# Altium schematic sheet PLL.SchDoc
size 420 x 297 mm; SheetNumber: 5; SheetTotal: 7
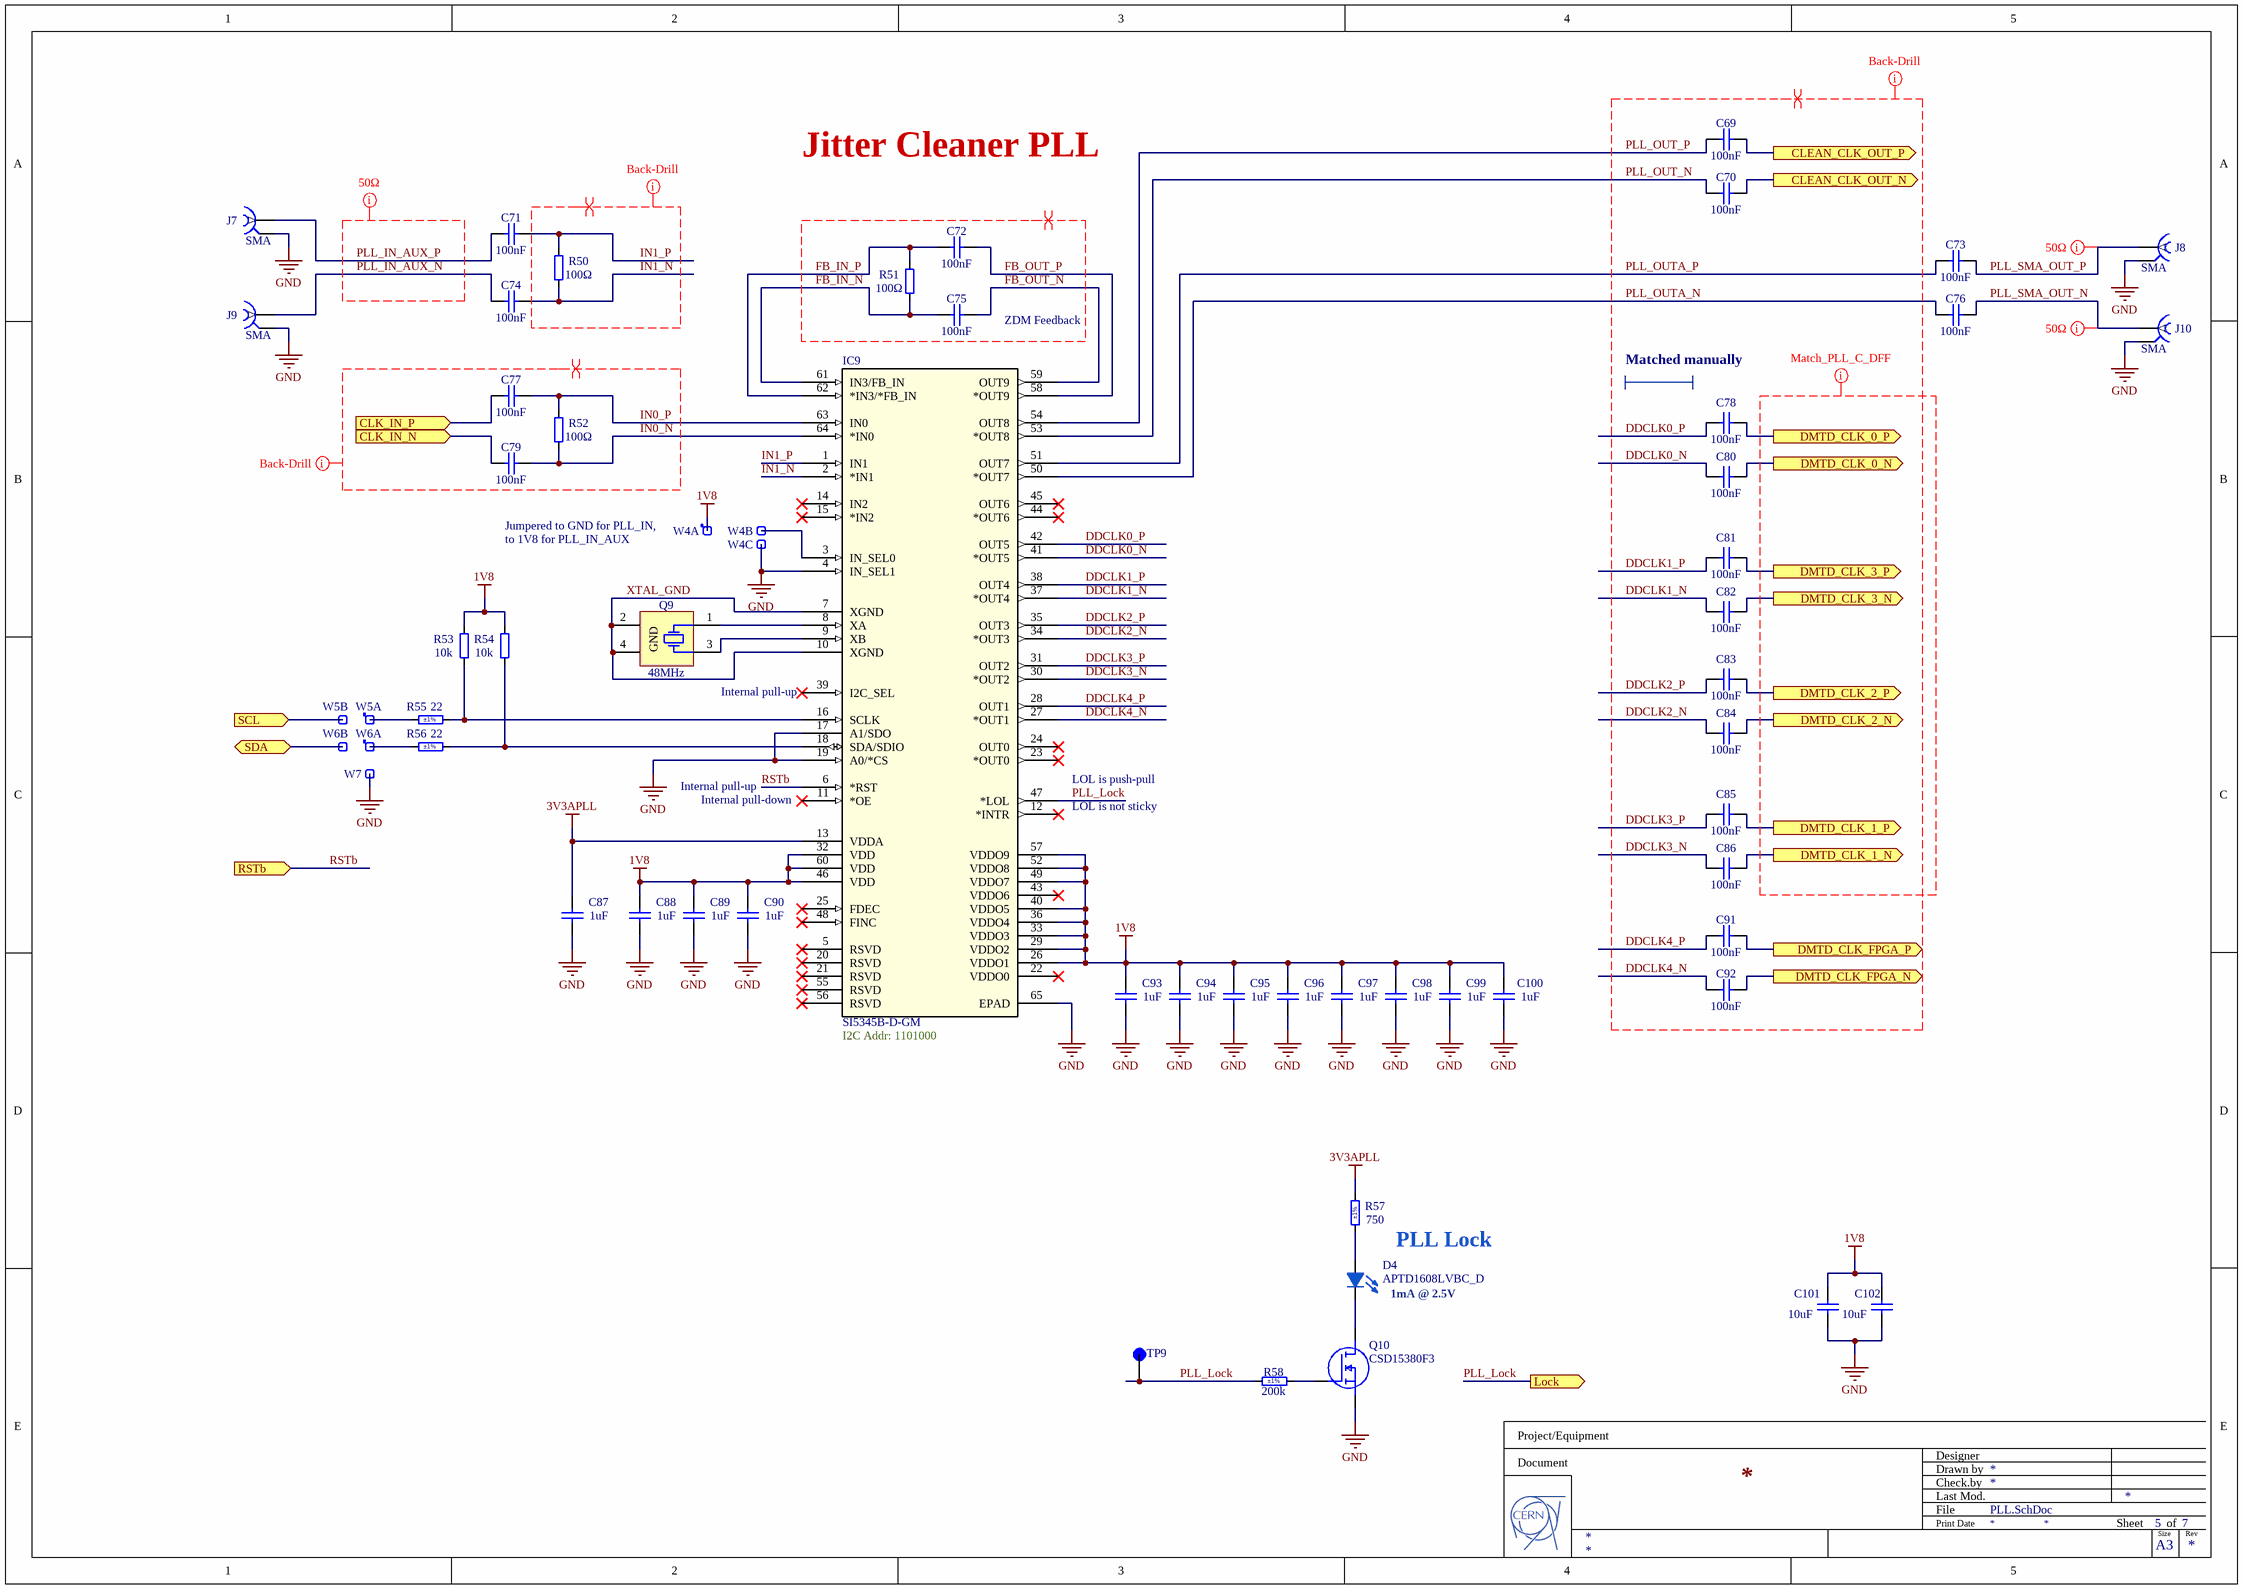
[diagram p0: PLL.SchDoc]

## Parts
C69  100nF  [MURATA_HI_DENSITY_0201]
C70  100nF  [MURATA_HI_DENSITY_0201]
C71  100nF  [MURATA_HI_DENSITY_0201]
C72  100nF  [MURATA_HI_DENSITY_0201]
C73  100nF  [MURATA_HI_DENSITY_0201]
C74  100nF  [MURATA_HI_DENSITY_0201]
C75  100nF  [MURATA_HI_DENSITY_0201]
C76  100nF  [MURATA_HI_DENSITY_0201]
C77  100nF  [MURATA_HI_DENSITY_0201]
C78  100nF  [MURATA_HI_DENSITY_0201]
C79  100nF  [MURATA_HI_DENSITY_0201]
C80  100nF  [MURATA_HI_DENSITY_0201]
C81  100nF  [MURATA_HI_DENSITY_0201]
C82  100nF  [MURATA_HI_DENSITY_0201]
C83  100nF  [MURATA_HI_DENSITY_0201]
C84  100nF  [MURATA_HI_DENSITY_0201]
C85  100nF  [MURATA_HI_DENSITY_0201]
C86  100nF  [MURATA_HI_DENSITY_0201]
C87  1uF  [CAPC1005X55N]
C88  1uF  [CAPC1005X55N]
C89  1uF  [CAPC1005X55N]
C90  1uF  [CAPC1005X55N]
C91  100nF  [MURATA_HI_DENSITY_0201]
C92  100nF  [MURATA_HI_DENSITY_0201]
C93  1uF  [CAPC1005X55N]
C94  1uF  [CAPC1005X55N]
C95  1uF  [CAPC1005X55N]
C96  1uF  [CAPC1005X55N]
C97  1uF  [CAPC1005X55N]
C98  1uF  [CAPC1005X55N]
C99  1uF  [CAPC1005X55N]
C100  1uF  [CAPC1005X55N]
C101  10uF  [CAPC1608X87N]
C102  10uF  [CAPC1608X87N]
D4  APTD1608LVBC_D  [LEDC1608X110N]
IC9  SI5345B-D-GM  [QFN50P900X900X90-65N-D]
J7  SMA  [SAMTEC_SMA-J-P-H-ST-MT1]
J8  SMA  [SAMTEC_SMA-J-P-H-ST-MT1]
J9  SMA  [SAMTEC_SMA-J-P-H-ST-MT1]
J10  SMA  [SAMTEC_SMA-J-P-H-ST-MT1]
Q9  48MHz  [XTAL_KYOCERA_CX3225SB]
Q10  CSD15380F3  [CSD15380F3]
R50  100Ω  [MURATA_HI_DENSITY_0201]
R51  100Ω  [MURATA_HI_DENSITY_0201]
R52  100Ω  [MURATA_HI_DENSITY_0201]
R53  10k  [MURATA_HI_DENSITY_0201]
R54  10k  [MURATA_HI_DENSITY_0201]
R55  22  Tolerance: ±1%  [RESC1005X40N]
R56  22  Tolerance: ±1%  [RESC1005X40N]
R57  750  Tolerance: ±1%  [RESC1005X40N]
R58  200k  Tolerance: ±1%  [RESC1005X40N]
TP9  RCU-0C  [TP+195X110]  (value not drawn)
W4  Header 3  [SAMTEC_HTSW-103-23-L-S]  (value not drawn)  (parts A,B,C of 3)
W5  Header 2  [SAMTEC_HTSW-102-23-L-S]  (value not drawn)  (parts A,B of 2)
W6  Header 2  [SAMTEC_HTSW-102-23-L-S]  (value not drawn)  (parts A,B of 2)
W7  Header 1  [SAMTEC_HTSW-101-23-L-S]  (value not drawn)

## Ports
CLEAN_CLK_OUT_N (out), CLEAN_CLK_OUT_P (out), CLK_IN_N (in), CLK_IN_P (in), DMTD_CLK_0_N (out), DMTD_CLK_0_P (out), DMTD_CLK_1_N (out), DMTD_CLK_1_P (out), DMTD_CLK_2_N (out), DMTD_CLK_2_P (out), DMTD_CLK_3_N (out), DMTD_CLK_3_P (out), DMTD_CLK_FPGA_N (out), DMTD_CLK_FPGA_P (out), Lock (out), RSTb (in), SCL (in), SDA (bidir)

## Nets
1V8: C88.2 C89.2 C90.2 C93.2 C94.2 C95.2 C96.2 C97.2 C98.2 C99.2 C100.2 C101.2 C102.2 IC9.26(VDDO1) IC9.29(VDDO2) IC9.32(VDD) IC9.33(VDDO3) IC9.36(VDDO4) IC9.40(VDDO5) IC9.46(VDD) IC9.49(VDDO7) IC9.52(VDDO8) IC9.57(VDDO9) IC9.60(VDD) R53.2 R54.2 W4.1
3V3APLL: C87.2 IC9.13(VDDA) R57.2
GND: C87.1 C88.1 C89.1 C90.1 C93.1 C94.1 C95.1 C96.1 C97.1 C98.1 C99.1 C100.1 C101.1 C102.1 IC9.4(IN_SEL1) IC9.17(A1/SDO) IC9.19(A0/*CS) IC9.65(EPAD) J7.2 J8.2 J9.2 J10.2 Q10.2(S) W4.3 W7.1
CLEAN_CLK_OUT_N: C70.2 ; port CLEAN_CLK_OUT_N
CLEAN_CLK_OUT_P: C69.2 ; port CLEAN_CLK_OUT_P
CLK_IN_N: C79.2 ; port CLK_IN_N
CLK_IN_P: C77.2 ; port CLK_IN_P
DDCLK0_N: C80.1 IC9.41(*OUT5)
DDCLK0_P: C78.1 IC9.42(OUT5)
DDCLK1_N: C82.1 IC9.37(*OUT4)
DDCLK1_P: C81.1 IC9.38(OUT4)
DDCLK2_N: C84.1 IC9.34(*OUT3)
DDCLK2_P: C83.1 IC9.35(OUT3)
DDCLK3_N: C86.1 IC9.30(*OUT2)
DDCLK3_P: C85.1 IC9.31(OUT2)
DDCLK4_N: C92.1 IC9.27(*OUT1)
DDCLK4_P: C91.1 IC9.28(OUT1)
DMTD_CLK_0_N: C80.2 ; port DMTD_CLK_0_N
DMTD_CLK_0_P: C78.2 ; port DMTD_CLK_0_P
DMTD_CLK_1_N: C86.2 ; port DMTD_CLK_1_N
DMTD_CLK_1_P: C85.2 ; port DMTD_CLK_1_P
DMTD_CLK_2_N: C84.2 ; port DMTD_CLK_2_N
DMTD_CLK_2_P: C83.2 ; port DMTD_CLK_2_P
DMTD_CLK_3_N: C82.2 ; port DMTD_CLK_3_N
DMTD_CLK_3_P: C81.2 ; port DMTD_CLK_3_P
DMTD_CLK_FPGA_N: C92.2 ; port DMTD_CLK_FPGA_N
DMTD_CLK_FPGA_P: C91.2 ; port DMTD_CLK_FPGA_P
FB_IN_N: C75.1 IC9.61(IN3/FB_IN) R51.1
FB_IN_P: C72.1 IC9.62(*IN3/*FB_IN) R51.2
FB_OUT_N: C75.2 IC9.59(OUT9)
FB_OUT_P: C72.2 IC9.58(*OUT9)
IN0_N: C79.1 IC9.64(*IN0) R52.1
IN0_P: C77.1 IC9.63(IN0) R52.2
IN1_N: C74.1 IC9.2(*IN1) R50.1
IN1_P: C71.1 IC9.1(IN1) R50.2
PLL_IN_AUX_N: C74.2 J9.1
PLL_IN_AUX_P: C71.2 J7.1
PLL_Lock: IC9.47(*LOL) R58.1 TP9.1(TP) ; port Lock
PLL_OUT_N: C70.1 IC9.53(*OUT8)
PLL_OUT_P: C69.1 IC9.54(OUT8)
PLL_OUTA_N: C76.1 IC9.50(*OUT7)
PLL_OUTA_P: C73.1 IC9.51(OUT7)
PLL_SMA_OUT_N: C76.2 J10.1
PLL_SMA_OUT_P: C73.2 J8.1
RSTb: IC9.6(*RST) ; port RSTb
SCL: W5.2 ; port SCL
SDA: W6.2 ; port SDA
XTAL_GND: IC9.7(XGND) IC9.10(XGND) Q9.2(GND) Q9.4(GND)
NetD4_1: D4.1(K) Q10.3(D)
NetD4_2: D4.2(A) R57.1
NetIC9_3: IC9.3(IN_SEL0) W4.2
NetIC9_8: IC9.8(XA) Q9.1(X)
NetIC9_9: IC9.9(XB) Q9.3(X)
NetIC9_16: IC9.16(SCLK) R53.1 R55.2
NetIC9_18: IC9.18(SDA/SDIO) R54.1 R56.2
NetQ10_1: Q10.1(G) R58.2
NetR55_1: R55.1 W5.1
NetR56_1: R56.1 W6.1

Not connected (* = marked no-connect by the designer): IC9 5(RSVD)* 11(*OE)* 12(*INTR)* 14(IN2)* 15(*IN2)* 20(RSVD)* 21(RSVD)* 22(VDDO0)* 23(*OUT0)* 24(OUT0)* 25(FDEC)* 39(I2C_SEL)* 43(VDDO6)* 44(*OUT6)* 45(OUT6)* 48(FINC)* 55(RSVD)* 56(RSVD)*

## Layout directives
differential pair: DDCLK0_N, DDCLK0_P, DDCLK1_N, DDCLK1_P, DDCLK2_N, DDCLK2_P, DDCLK3_N, DDCLK3_P, DDCLK4_N, DDCLK4_P, FB_IN_N, FB_IN_P, FB_OUT_N, FB_OUT_P, IN0_N, IN0_P, IN1_N, IN1_P, PLL_OUT_N, PLL_OUT_P, PLL_OUTA_N, PLL_OUTA_P
net class Back-Drill: DDCLK0_N, DDCLK0_P, DDCLK1_N, DDCLK1_P, DDCLK2_N, DDCLK2_P, DDCLK3_N, DDCLK3_P, DDCLK4_N, DDCLK4_P, IN0_N, IN0_P, IN1_N, IN1_P, PLL_OUT_N, PLL_OUT_P, PLL_OUTA_N, PLL_OUTA_P
net class Match_PLL_C_DFF: DDCLK0_N, DDCLK0_P, DDCLK1_N, DDCLK1_P, DDCLK2_N, DDCLK2_P, DDCLK3_N, DDCLK3_P, DDCLK4_N, DDCLK4_P, PLL_OUT_N, PLL_OUT_P, PLL_OUTA_N, PLL_OUTA_P
net class 50ohm: PLL_IN_AUX_N, PLL_IN_AUX_P, PLL_SMA_OUT_N, PLL_SMA_OUT_P

## Notes on the sheet
- Jitter Cleaner PLL
- ZDM Feedback
- Matched manually
- Jumpered to GND for PLL_IN, to 1V8 for PLL_IN_AUX
- (near IC9) Internal pull-up
- Internal pull-up
- (near IC9) Internal pull-down
- LOL is push-pull
- LOL is not sticky
- (near IC9) I2C Addr: 1101000
- PLL Lock
- 1mA @ 2.5V
- Project/Equipment
- Document
- Designer
- Drawn by
- Check.by
- File
- Last Mod.
- Print Date
- Sheet
- Size
- A3
- of
- Rev

## Library data of the parts
C69-C86 C91 C92 = C0201-100nF-high-density: GRM033R61C104KE14; Vmax: 16V; Value: 100nF
C87-C90 C93-C100 = CC0402_1UF_16V_10%_X5R: GRM153B30J105ME15; Part Description: SMD Multilayer Chip Ceramic Capacitor; Manufacturer: GENERIC; Manufacturer1 Part Number: C1005X5R1C105KT; Voltage: 16V; TC: X5R; Tolerance: ±10%; Part Number: CC0402_1UF_16V_10%_X5R; Component Kind: Standard; Component Type: Standard; Pin Count: 2; Value: 1uF; Status: Preferred; Manufacturer Part Number: CC0402_1UF_16V_10%_X5R; Case: 0402; Mounted: Yes; Socket: No; SMD: Yes; Sense: No; Manufacturer1 Example: TDK; Manufacturer1 ComponentHeight: 0.55mm; HelpURL: \\cern.ch\dfs\Applications\Altium\Datasheets\CC0402_X5R_TDK_C.pdf; Author: CERN DEM JLC; CreateDate: 10/25/2012; LatestRevisionDate: 10/25/2012
C101 C102 = CC0603_10UF_6.3V_20%_X5R: C1608X5R1E106M080AC; Part Description: SMD Multilayer Chip Ceramic Capacitor; Manufacturer: GENERIC; Manufacturer1 Part Number: C0603C106M9PAC; Voltage: 6.3V; TC: X5R; Tolerance: ±20%; Part Number: CC0603_10UF_6.3V_20%_X5R; Component Kind: Standard; Component Type: Standard; Pin Count: 2; Value: 10uF; Status: Preferred; Manufacturer Part Number: CC0603_10uF_6.3V_20%_X5R; Case: 0603; Mounted: Yes; Socket: No; SMD: Yes; Sense: No; Manufacturer1 Example: KEMET; Manufacturer1 ComponentHeight: 0.95mm; HelpURL: \\cern.ch\dfs\Applications\Altium\Datasheets\CC0603_X5R_KEMET.pdf; Author: CERN DEM JLC; CreateDate: 03/12/2007; LatestRevisionDate: 03/12/2007
D4 = APTD1608LVBC_D: LED; Manufacturer_Name: Kingbright; Manufacturer_Part_Number: APTD1608LVBC/D; Datasheet Link: https://componentsearchengine.com/Datasheets/1/APTD1608LVBC_D.pdf; Height: 1.1mm; Mouser Part Number: 604-APTD1608LVBCD; Mouser Price/Stock: https://www.mouser.co.uk/ProductDetail/Kingbright/APTD1608LVBC-D?qs=6oMev5NRZMEfNSg5xIhlKA%3D%3D; Arrow Part Number: APTD1608LVBC/D; Arrow Price/Stock: https://www.arrow.com/en/products/aptd1608lvbcd/kingbright?utm_currency=USD&region=nac
IC9 = SI5345B-D-GM: Integrated Circuit; Manufacturer_Name: Skyworks; Datasheet Link: https://www.mouser.sg/datasheet/2/472/si5345_44_42_d_datasheet-2507675.pdf; Height: 0.9mm; Manufacturer_Part_Number: SI5345B-D-GM; Mouser Part Number: 634-SI5345B-D-GM; Mouser Price/Stock: https://www.mouser.co.uk/ProductDetail/Skyworks-Solutions-Inc/SI5345B-D-GM?qs=p9T7GgSe1IGHqFUKlxUKrA%3D%3D
J7-J10 = SAMTEC_SMA-J-P-H-ST-MT1: Part Description: 50 Ohms SMA Straight Mixed Technology PCB Jack; Manufacturer: SAMTEC; PressFit: No; Sense Comment: assembly limitations; Part Number: SAMTEC_SMA-J-P-H-ST-MT1; Component Kind: Standard; Component Type: Standard; Pin Count: 5; Family: SMA; Mounted: Yes; Socket: No; SMD: Yes; Sense: Yes; Status: Not Recommended; Manufacturer Part Number: SMA-J-P-H-ST-MT1; ComponentHeight: 7.95mm; HelpURL: \\cern.ch\dfs\Applications\Altium\Datasheets\SAMTEC_SMA-J-P-H-ST-MT1.pdf; Author: CERN DEM HF; CreateDate: 5/24/2023; LatestRevisionDate: 5/24/2023
Q9 = XTAL_48MHZ_KYOCERA_CX3225SB48000D0FPJC1: Crystal 4 pins 1=XTAL Control 2=GND3=XTAL 4=GND; Part Description: Tolerance: ±10ppm, Stability: ±15ppm, 8pF, -40°C to +85°C, Surface Mount Crystal; PressFit: No; Bonding: No; Part Number: XTAL_48MHZ_KYOCERA_CX3225SB48000D0FPJC1; Component Kind: Standard; Component Type: Standard; PackageDescription: SMD Crystal Kyocera, 4 Pins, 2.50mm L X 3.20mm W X 0.6mm H; Value: 48MHz; Manufacturer: KYOCERA; Manufacturer Part Number: CX3225SB48000D0FPJC1; Pin Count: 4; Mounted: Yes; Socket: No; SMD: Yes; Sense: No; ComponentHeight: 0.6mm; HelpURL: \\cern.ch\dfs\Applications\Altium\Datasheets\XTAL_KYOCERA_CX3225SB.pdf; Author: CERN DEM JLC; CreateDate: 6/5/2018; LatestRevisionDate: 6/5/2018
Q10 = CSD15380F3: MOSFET (N-Channel); Manufacturer_Name: Texas Instruments; Datasheet Link: https://www.ti.com/lit/ds/symlink/csd15380f3.pdf?ts=1641221366106&ref_url=https%253A%252F%252Fwww.google.com%252F; Height: 0.35mm; Manufacturer_Part_Number: CSD15380F3; Mouser Part Number: 595-CSD15380F3; Mouser Price/Stock: https://www.mouser.co.uk/ProductDetail/Texas-Instruments/CSD15380F3?qs=zEmsApcVOkXP46xhm0edmA%3D%3D; Arrow Part Number: CSD15380F3; Arrow Price/Stock: https://www.arrow.com/en/products/csd15380f3/texas-instruments?region=nac
R50-R52 = R0201-100ohm-high-density: Resistor; Value: 100Ω
R53 R54 = R0201-100ohm-high-density: Resistor 10k; Value: 100Ω
R55 R56 = R0402_22R_1%_0.0625W_100PPM: Resistor - 1%; Part Description: General Purpose Thick Film Chip Resistor; Manufacturer: GENERIC; Manufacturer1 Part Number: 232270672209L; TC: ±100ppm/°C; PressFit: No; Part Number: R0402_22R_1%_0.0625W_100PPM; Component Kind: Standard; Component Type: Standard; Pin Count: 2; Value: 22; Status: Not Recommended; Power: 0.0625W; Manufacturer Part Number: R0402_22R_1%_0.0625W_100PPM; Case: 0402; Mounted: Yes; Sense: No; Socket: No; SMD: Yes; Manufacturer1 Example: YAGEO PHYCOMP; Manufacturer1 ComponentHeight: 0.4mm; HelpURL: \\cern.ch\dfs\Applications\Altium\Datasheets\R0402_Phycomp_RC0402.pdf; Author: CERN DEM JLC; CreateDate: 12/3/2007; LatestRevisionDate: 10/17/2012
R57 = R0402_750R_1%_0.0625W_100PPM: Resistor - 1%; Part Description: General Purpose Thick Film Chip Resistor; Manufacturer: GENERIC; Manufacturer1 Part Number: 232270677501L; TC: ±100ppm/°C; PressFit: No; Part Number: R0402_750R_1%_0.0625W_100PPM; Component Kind: Standard; Component Type: Standard; Pin Count: 2; Value: 750; Status: Not Recommended; Power: 0.0625W; Manufacturer Part Number: R0402_750R_1%_0.0625W_100PPM; Case: 0402; Mounted: Yes; Sense: No; Socket: No; SMD: Yes; Manufacturer1 Example: YAGEO PHYCOMP; Manufacturer1 ComponentHeight: 0.4mm; HelpURL: \\cern.ch\dfs\Applications\Altium\Datasheets\R0402_Phycomp_RC0402.pdf; Author: CERN DEM JLC; CreateDate: 12/3/2007; LatestRevisionDate: 10/17/2012
R58 = R0402_200K_1%_0.0625W_100PPM: Resistor - 1%; Part Description: General Purpose Thick Film Chip Resistor; Manufacturer: GENERIC; Manufacturer1 Part Number: 232270672004L; TC: ±100ppm/°C; PressFit: No; Part Number: R0402_200K_1%_0.0625W_100PPM; Component Kind: Standard; Component Type: Standard; Pin Count: 2; Value: 200k; Status: Not Recommended; Power: 0.0625W; Manufacturer Part Number: R0402_200K_1%_0.0625W_100PPM; Case: 0402; Mounted: Yes; Sense: No; Socket: No; SMD: Yes; Manufacturer1 Example: YAGEO PHYCOMP; Manufacturer1 ComponentHeight: 0.4mm; HelpURL: \\cern.ch\dfs\Applications\Altium\Datasheets\R0402_Phycomp_RC0402.pdf; Author: CERN DEM JLC; CreateDate: 12/3/2007; LatestRevisionDate: 10/17/2012
TP9 = RCU-0C: MF: {'manufacturer': u'TE Connectivity AMP Connectors'}; Package: None; Price: None; Value: *; MP: RCU-0C; Availability: Unavailable
W4 = SAMTEC_HTSW-103-23-L-S: 3 Mini Wire-Wrap Contact Strip Header; Part Description: 3 Contacts, Pitch 2.54mm, Single Row Through Mount Straight Header (Post Lead 5.84mm, Tail Lead 2.92mm, Insulator 2.54mm); Manufacturer: SAMTEC; PressFit: No; Status Comment: High Temperature; Part Number: SAMTEC_HTSW-103-23-L-S; Component Kind: Standard; Component Type: Standard; Pin Count: 3; Family: Header 3; Mounted: Yes; Socket: No; SMD: No; Sense: No; Status: Preferred; Manufacturer Part Number: HTSW-103-23-L-S; ComponentHeight: 8.38mm; HelpURL: \\cern.ch\dfs\Applications\Altium\Datasheets\SAMTEC_HTSW-103-23-L-S.pdf; Author: CERN DEM JLC; CreateDate: 2/22/2018; LatestRevisionDate: 2/22/2018
W5 W6 = SAMTEC_HTSW-102-23-L-S: 2 Mini Wire-Wrap Contact Strip Header; Part Description: 2 Contacts, Pitch 2.54mm, Single Row  Through Mount Straight Header (Post Lead 5.84mm, Tail Lead 2.92mm, Insulator 2.54mm); Manufacturer: SAMTEC; PressFit: No; Status Comment: High Temperature; Part Number: SAMTEC_HTSW-102-23-L-S; Component Kind: Standard; Component Type: Standard; Pin Count: 2; Family: Header 2; Mounted: Yes; Socket: No; SMD: No; Sense: No; Status: Preferred; Manufacturer Part Number: HTSW-102-23-L-S; ComponentHeight: 8.38mm; HelpURL: \\cern.ch\dfs\Applications\Altium\Datasheets\SAMTEC_HTSW-102-23-L-S.pdf; Author: CERN DEM JLC; CreateDate: 2/22/2018; LatestRevisionDate: 2/22/2018
W7 = SAMTEC_HTSW-101-23-L-S: Single Mini Wire-Wrap Contact; Part Description: Single Contact Through Mount Straight Header (Post Lead 5.84mm, Tail Lead 2.92mm, Insulator 2.54mm); Manufacturer: SAMTEC; PressFit: No; Status Comment: High Temperature; Part Number: SAMTEC_HTSW-101-23-L-S; Component Kind: Standard; Component Type: Standard; Pin Count: 1; Family: Header 1; Mounted: Yes; Socket: No; SMD: No; Sense: No; Status: Preferred; Manufacturer Part Number: HTSW-101-23-L-S; ComponentHeight: 8.38mm; HelpURL: \\cern.ch\dfs\Applications\Altium\Datasheets\SAMTEC_HTSW-101-23-L-S.pdf; Author: CERN DEM JLC; CreateDate: 2/22/2018; LatestRevisionDate: 2/22/2018